# EAGLE schematic lc_meter (EAGLE 9.2.2)
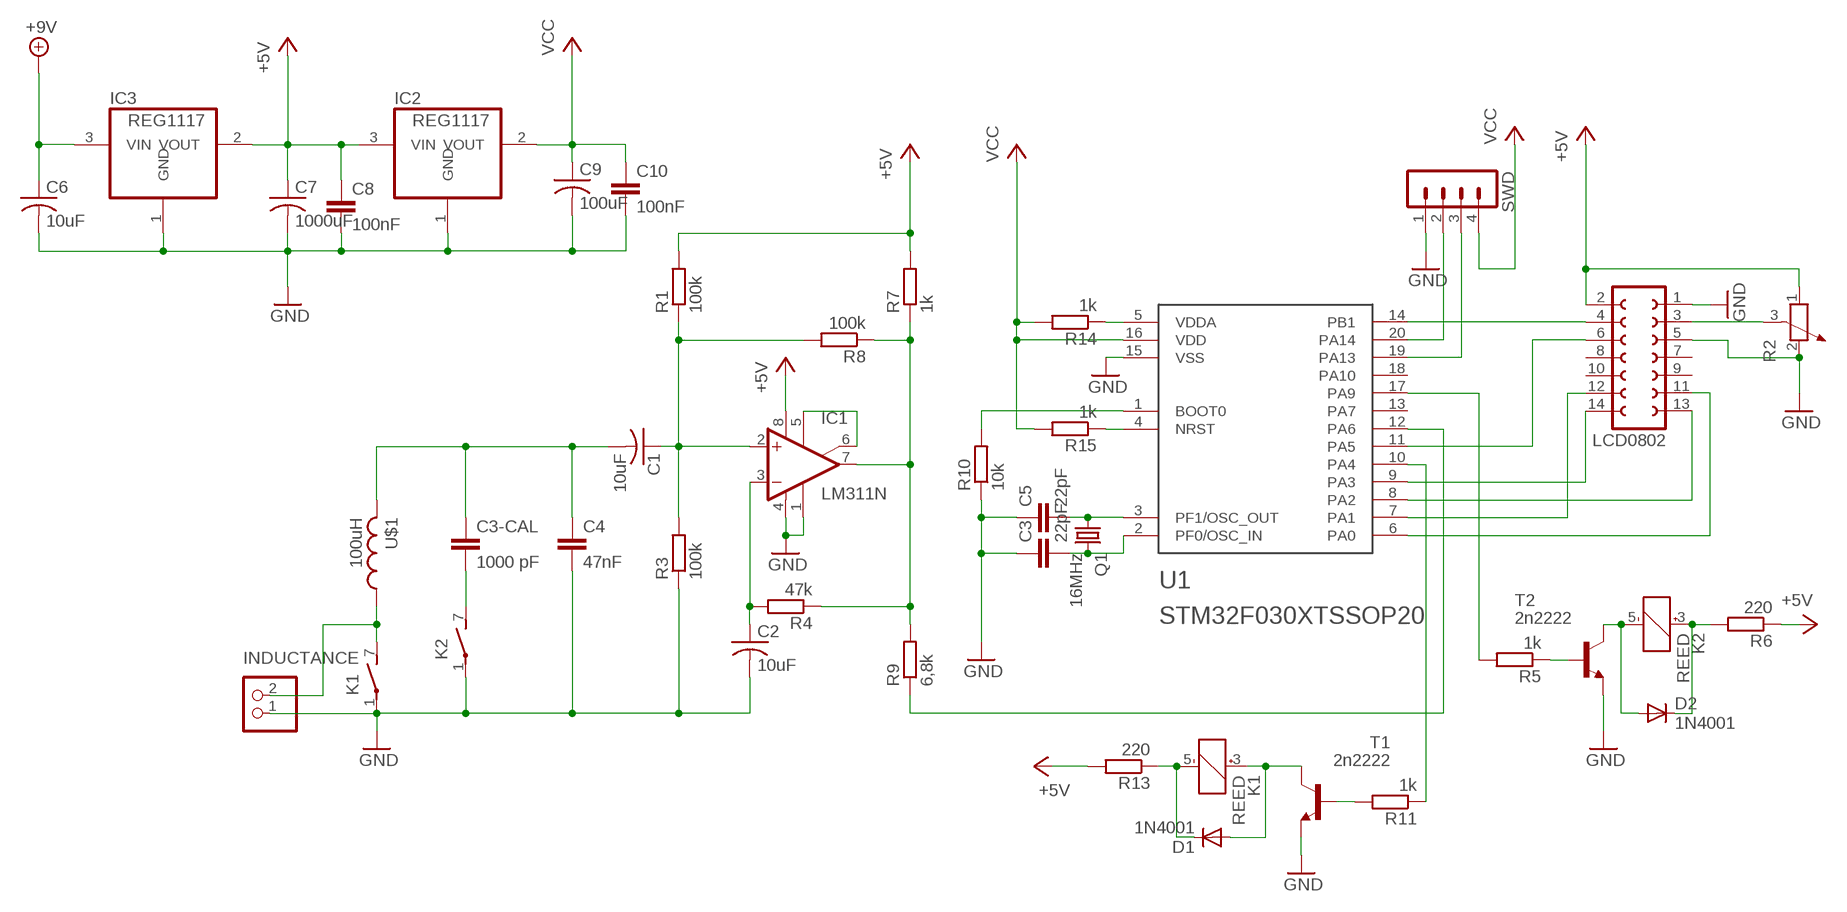
[diagram p0: schematic, sheet 1]

## Parts
C1  10uF  C-US025-024X044  [C025-024X044]
C2  10uF  C-US025-024X044  [C025-024X044]
C3  22pF  C2,5-3  [C2.5-3]
C3-CAL  1000 pF  C2,5-3  [C2.5-3]
C4  47nF  C2,5-3  [C2.5-3]
C5  22pF  C2,5-3  [C2.5-3]
C6  10uF  C-US025-024X044  [C025-024X044]
C7  1000uF  C-US025-024X044  [C025-024X044]
C8  100nF  C2,5-3  [C2.5-3]
C9  100uF  C-US025-024X044  [C025-024X044]
C10  100nF  C2,5-3  [C2.5-3]
D1  1N4001  1N4004  [DO41-10]
D2  1N4001  1N4004  [DO41-10]
IC1  LM311N  [DIL08]
IC2  REG1117  [SOT223]
IC3  REG1117  [SOT223]
INDUCTANCE  PINHD-1X2  [1X02]
K1  REED  [REED]
K2  REED  [REED]
LCD0802  FE07-2  [FE07-2]
Q1  16MHz  CRYSTALHC18U-V  [HC18U-V]
R1  100k  R0204/7  [0204/7]
R2  POTENTIOMETER_PT_SPIN  [PT-SPIN]
R3  100k  R0204/7  [0204/7]
R4  47k  R0204/7  [0204/7]
R5  1k  R0204/7  [0204/7]
R6  220  R0204/7  [0204/7]
R7  1k  R0204/7  [0204/7]
R8  100k  R0204/7  [0204/7]
R9  6,8k  R0204/7  [0204/7]
R10  10k  R0204/7  [0204/7]
R11  1k  R0204/7  [0204/7]
R13  220  R0204/7  [0204/7]
R14  1k  R0204/7  [0204/7]
R15  1k  R0204/7  [0204/7]
SWD  MA04-1  [MA04-1]
T1  2n2222  2N2222-NPN-TO92-EBC  [TO92-EBC]
T2  2n2222  2N2222-NPN-TO92-EBC  [TO92-EBC]
U1  STM32F030XTSSOP20  [TSSOP-20]
U$1  100uH  INDUCTOR_0805_N  [RESC0805_N]

## Nets
+5V: C7.1 C8.1 IC1.8(V+) IC2.3(VIN) IC3.2(VOUT) LCD0802.2 R1.2 R2.1 R6.1 R7.2 R13.2
+9V: C6.1 IC3.3(VIN)
GND: C2.2 C3.1 C4.2 C5.1 C6.2 C7.2 C8.2 C9.2 C10.2 IC1.1(GND) IC1.4(V-) IC2.1(GND) IC3.1(GND) INDUCTANCE.1 K1.1(2:P) K2.1(2:P) LCD0802.1 LCD0802.5 R2.2 R3.1 R10.1 SWD.1 T1.E T2.E U1.15(VSS)
N$1: C1.1 IC1.2(+IN) R1.1 R3.2 R8.2
N$2: C2.1 IC1.3(-IN) R4.2
N$3: C1.2 C3-CAL.1 C4.1 U$1.2
N$5: R11.1 U1.10(PA4)
N$6: IC1.5(ON) IC1.6(ON/STR)
N$7: C5.2 Q1.1 U1.3(PF1/OSC_OUT)
N$8: IC1.7(OUT) R4.1 R7.1 R8.1 R9.2
N$9: C3.2 Q1.2 U1.2(PF0/OSC_IN)
N$10: LCD0802.11 U1.6(PA0)
N$11: LCD0802.12 U1.7(PA1)
N$12: LCD0802.13 U1.8(PA2)
N$13: R11.2 T1.B
N$14: D1.A K1.3(1:+) T1.C
N$15: D1.C K1.5(1:-) R13.1
N$16: R9.1 U1.12(PA6)
N$17: R15.1 U1.4(NRST)
N$18: R14.1 U1.5(VDDA)
N$19: R10.2 U1.1(BOOT0)
N$20: LCD0802.14 U1.9(PA3)
N$21: LCD0802.3 R2.3
N$22: C3-CAL.2 K2.7(2:S)
N$23: LCD0802.4 U1.14(PB1)
N$24: LCD0802.6 U1.11(PA5)
N$25: R5.2 U1.17(PA9)
N$26: INDUCTANCE.2 K1.7(2:S) U$1.1
N$27: SWD.2 U1.20(PA14)
N$28: SWD.3 U1.19(PA13)
N$29: R5.1 T2.B
N$30: D2.A K2.5(1:-) T2.C
N$31: D2.C K2.3(1:+) R6.2
VCC: C9.1 C10.1 IC2.2(VOUT) R14.2 R15.2 SWD.4 U1.16(VDD)
Unconnected: LCD0802.7 LCD0802.8 LCD0802.9 LCD0802.10 U1.13(PA7) U1.18(PA10)

## Library data of the parts
C1 C2 C6 C7 C9 = adafruit:C-US: CAPACITOR, American symbol
C3 C3-CAL C4 C5 C8 C10 = capacitor-wima:C: CAPACITOR naming: grid - package width
D1 D2 = diode:1N4004: DIODE general purpose rectifier, 1 A
IC1 = linear:LM311: COMPARATOR
IC2 IC3 = burr-brown:REG1117: 800mA and 1A Low Dropout (LDO) Positive Regulator 1.8V, 2.5V, 2.85V, 3.3V, 5V, and Adj; MPN: REG1117; OC_FARNELL: 1097566; OC_NEWARK: 14P6981
INDUCTANCE = pinhead:PINHD-1X2: PIN HEADER
K1 K2 = relay:REED: RELAY reed, 1 x norm. open with polarity, grid 5.08; OC_FARNELL: unknown; OC_NEWARK: unknown
LCD0802 = con-lsta:FE07-2: FEMALE HEADER; OC_FARNELL: unknown; OC_NEWARK: unknown
Q1 = crystal:CRYSTAL: CRYSTAL; OC_FARNELL: unknown; OC_NEWARK: unknown
R1 R3-R11 R13-R15 = eagle-ltspice:R: RESISTOR, European symbol; SPICEMODEL: NONE; SPICEPREFIX: R
R2 = rcl:POTENTIOMETER_: Potentiometer; SPICEMODEL: POT; SPICEPREFIX: X
SWD = con-lstb:MA04-1: PIN HEADER; OC_FARNELL: unknown; OC_NEWARK: unknown
T1 T2 = transistor-neu-to92:*-NPN-: NPN Transistror
U1 = stm32f030x:STM32F030X
U$1 = Nordic_misc:INDUCTOR: Generic chip inductor